# EAGLE design Teensy_Intan_Module_JE_20170512 (EAGLE 7.7.0)
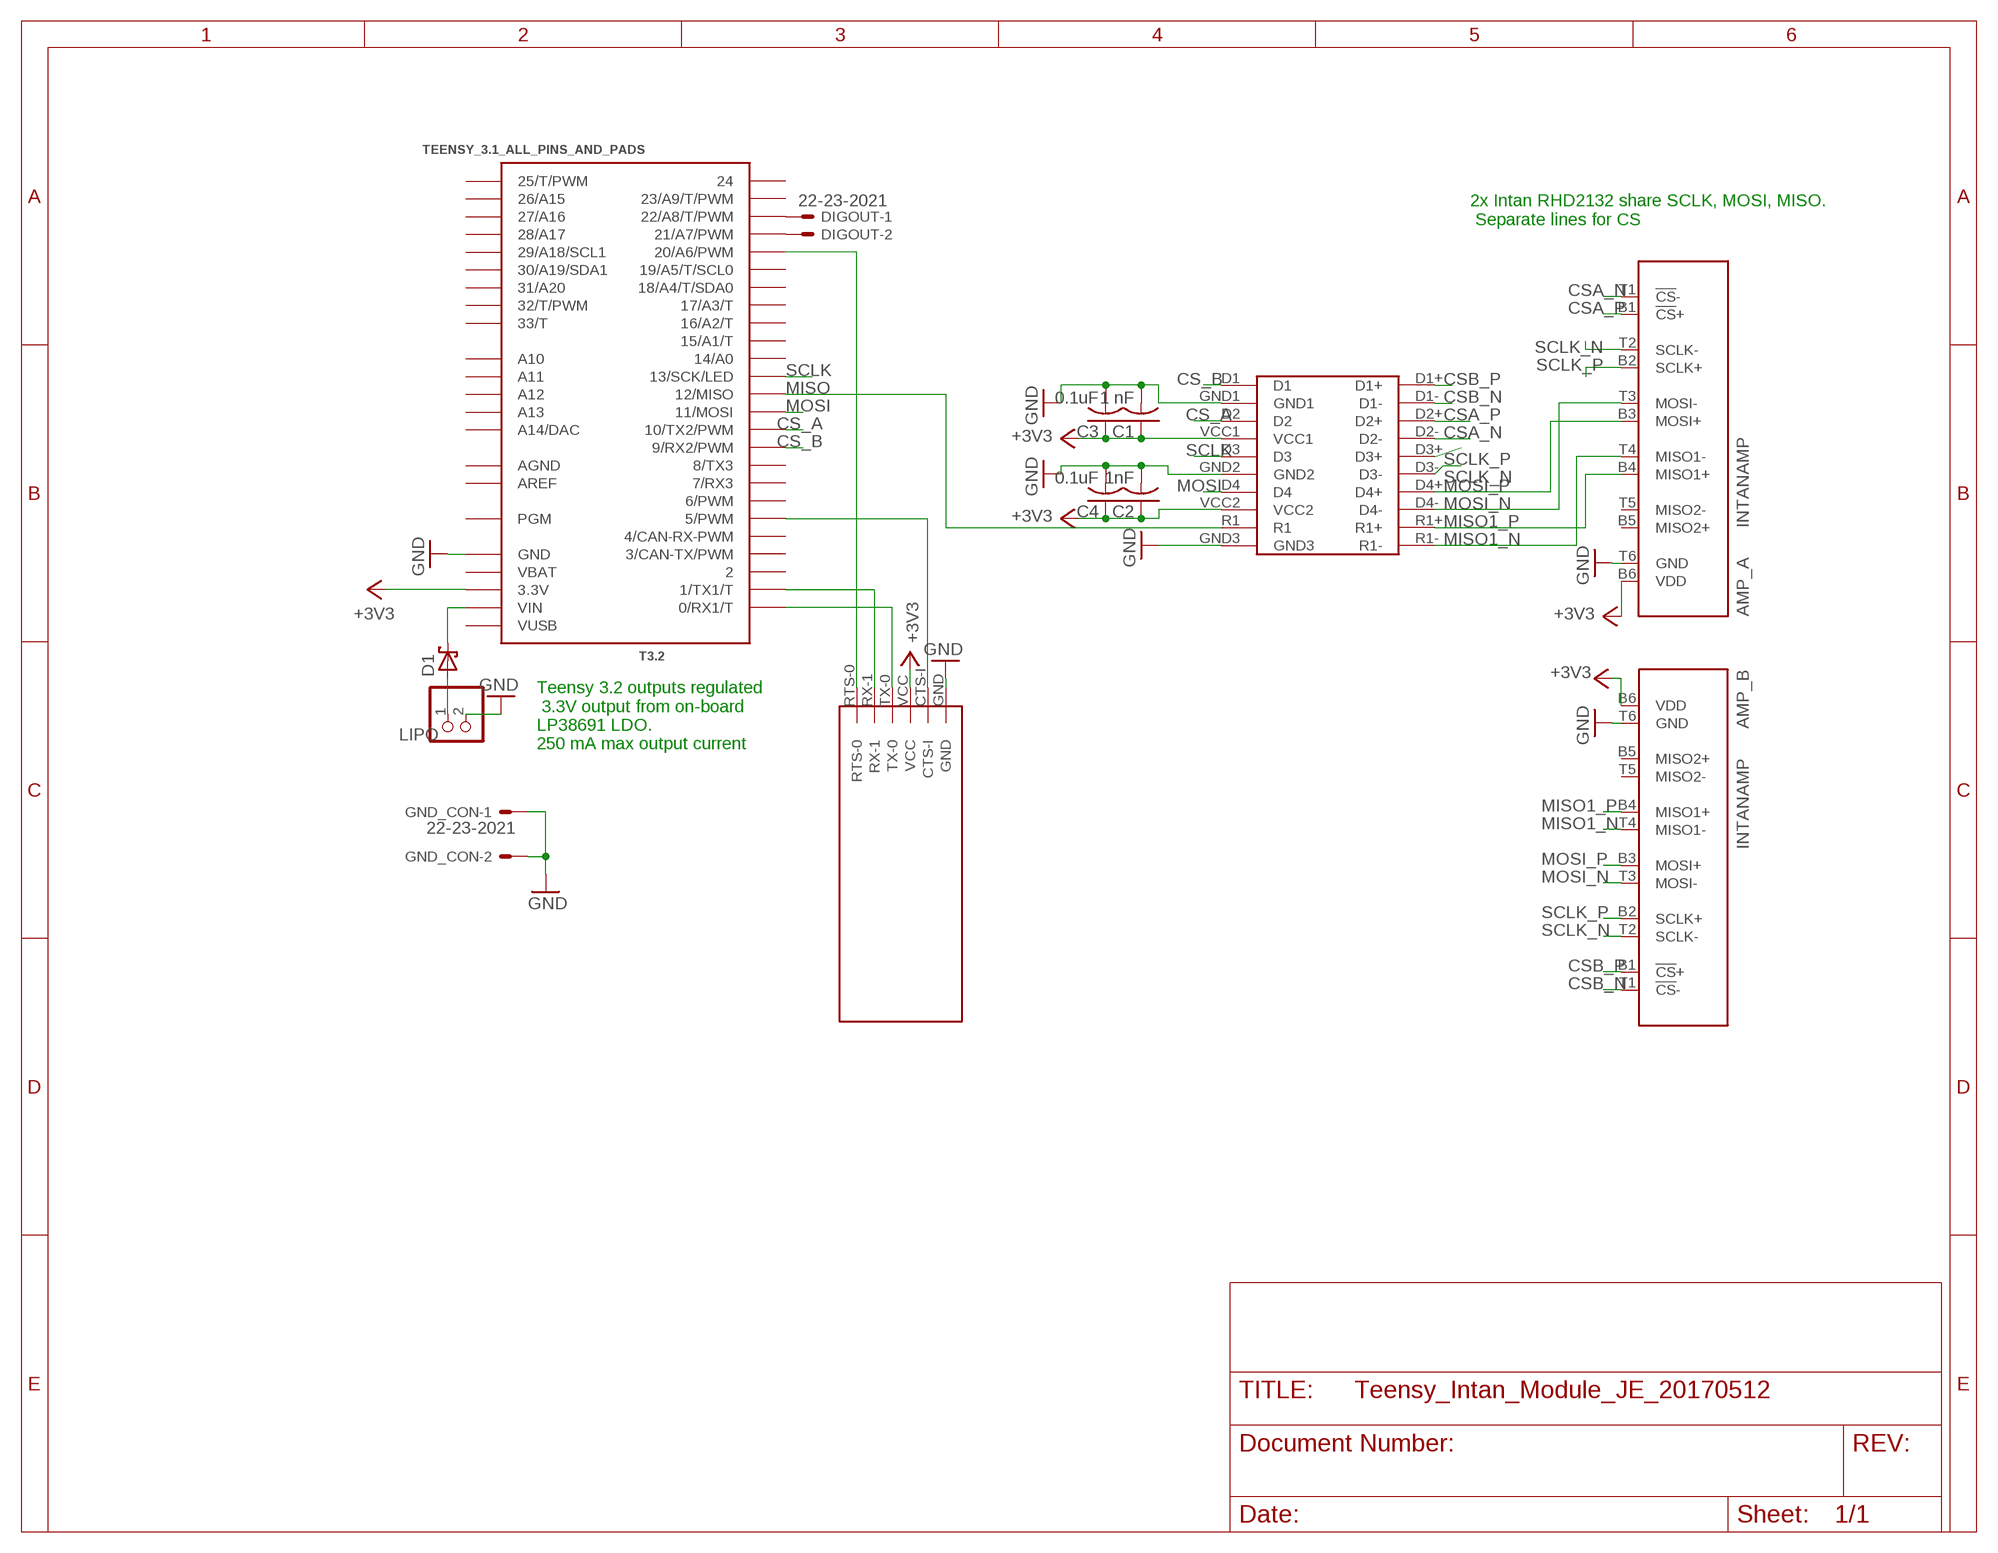
[diagram p0: schematic, sheet 1]

## Parts
AMP_A  INTANAMP  [AMPBOARD]
AMP_B  INTANAMP  [AMPBOARD]
C1  1 nF  C-US025-024X044  [C025-024X044]
C2  1nF  C-US025-024X044  [C025-024X044]
C3  0.1uF  C-US025-024X044  [C025-024X044]
C4  0.1uF  C-US025-024X044  [C025-024X044]
D1  SCHOTTKY-DIODEDO41-7  [DO41-7]
DIGOUT  22-23-2021  [22-23-2021]
GND_CON  22-23-2021  [22-23-2021]
LIPO  LIPO_BAT  JST_2PIN-THM  [JST-PH-2-THM]
RN42  RN42  [RN42]
T3.2  TEENSY_3.1_ALL_PINS_AND_PADS  [TEENSY_3.1_ALLPINS]
U$1  SCHMARTBOARD20PIN  [SCHMARTBOARD20PIN]

## Nets
+3V3: AMP_A.B6(VDD) AMP_B.B6(VDD) C1.1 C2.1 C3.1 C4.1 RN42.VCC T3.2.3.3V T3.2.3.3V1(3.3V) T3.2.3.3V2(3.3V) U$1.VCC1 U$1.VCC2
CS_A: T3.2.10(10/TX2/PWM) U$1.D2
CS_B: T3.2.9(9/RX2/PWM) U$1.D1
CSA_N: AMP_A.T1(!CS!-) U$1.D2-
CSA_P: AMP_A.B1(!CS!+) U$1.D2+
CSB_N: AMP_B.T1(!CS!-) U$1.D1-
CSB_P: AMP_B.B1(!CS!+) U$1.D1+
GND: AMP_A.T6(GND) AMP_B.T6(GND) C1.2 C2.2 C3.2 C4.2 GND_CON.1 GND_CON.2 LIPO.2 RN42.GND T3.2.GND T3.2.GND1(GND) T3.2.GND2(GND) U$1.GND1 U$1.GND2 U$1.GND3
MISO: T3.2.12(12/MISO) U$1.R1
MISO1_N: AMP_A.T4(MISO1-) AMP_B.T4(MISO1-) U$1.R1-
MISO1_P: AMP_A.B4(MISO1+) AMP_B.B4(MISO1+) U$1.R1+
MOSI: T3.2.11(11/MOSI) U$1.D4
MOSI_N: AMP_A.T3(MOSI-) AMP_B.T3(MOSI-) U$1.D4-
MOSI_P: AMP_A.B3(MOSI+) AMP_B.B3(MOSI+) U$1.D4+
N$1: D1.A LIPO.1
N$3: DIGOUT.1 T3.2.22/A8(22/A8/T/PWM)
N$4: DIGOUT.2 T3.2.21/A7(21/A7/PWM)
N$5: RN42.CTS-I T3.2.5(5/PWM)
N$6: RN42.RTS-0 T3.2.20/A6(20/A6/PWM)
RX-TN42: RN42.TX-0 T3.2.0(0/RX1/T)
SCLK: T3.2.13(13/SCK/LED) U$1.D3
SCLK_N: AMP_A.T2(SCLK-) AMP_B.T2(SCLK-) U$1.D3-
SCLK_P: AMP_A.B2(SCLK+) AMP_B.B2(SCLK+) U$1.D3+
TX-RN42: RN42.RX-1 T3.2.1(1/TX1/T)
VIN_LIPO: D1.C T3.2.VIN
Unconnected: AMP_A.B5(MISO2+) AMP_A.T5(MISO2-) AMP_B.B5(MISO2+) AMP_B.T5(MISO2-) T3.2.2 T3.2.3(3/CAN-TX/PWM) T3.2.4(4/CAN-RX-PWM) T3.2.6(6/PWM) T3.2.7(7/RX3) T3.2.8(8/TX3) T3.2.14/A0 T3.2.15/A1(15/A1/T) T3.2.16/A2(16/A2/T) T3.2.17/A3(17/A3/T) T3.2.18/A4(18/A4/T/SDA0) T3.2.19/A5(19/A5/T/SCL0) T3.2.23/A9(23/A9/T/PWM) T3.2.24 T3.2.25(25/T/PWM) T3.2.26(26/A15) T3.2.27(27/A16) T3.2.28(28/A17) T3.2.29(29/A18/SCL1) T3.2.30(30/A19/SDA1) T3.2.31(31/A20) T3.2.32(32/T/PWM) T3.2.33(33/T) T3.2.A10 T3.2.A11 T3.2.A12 T3.2.A13 T3.2.A14(A14/DAC) T3.2.PGM

## Notes on the sheet
- 2x Intan RHD2132 share SCLK, MOSI, MISO.
   Separate lines for CS
- Teensy 3.2 outputs regulated
   3.3V output from on-board 
  LP38691 LDO.
  250 mA max output current

## Power pins joined to a net without a drawn wire
AGND: T3.2.AGND
AREF: T3.2.AREF
VBAT: T3.2.VBAT
VUSB: T3.2.VUSB

## Library data of the parts
AMP_A AMP_B = INTANAMP:INTANAMP
C1-C4 = adafruit:C-US: CAPACITOR, American symbol
D1 = adafruit:SCHOTTKY-DIODE: Schottky Diode
DIGOUT GND_CON = con-molex:22-23-2021: .100" (2.54mm) Center Header - 2 Pin; MF: MOLEX; MPN: 22-23-2021; OC_FARNELL: 1462926; OC_NEWARK: 25C3832
LIPO = adafruit:JST_2PIN: JST 2-Pin Connectors of various flavors SMT-RA (S2B-PH-SM4) 4UConnector #17311 SMT (B2B-PH-SM4) THM-RA (S2B-PH) THM (B2B-PH)
RN42 = BLUETOOTH_MODULES:RN42
T3.2 = Teensy_3_Series_Board_v1.0:TEENSY_3.1_ALL_PINS_AND_PADS: Footprint for Teensy 3.1 board using all pads and all through-holes. Pads need a 2x7 0.1" SMD header.
U$1 = schmart:SCHMARTBOARD20PIN

## Board
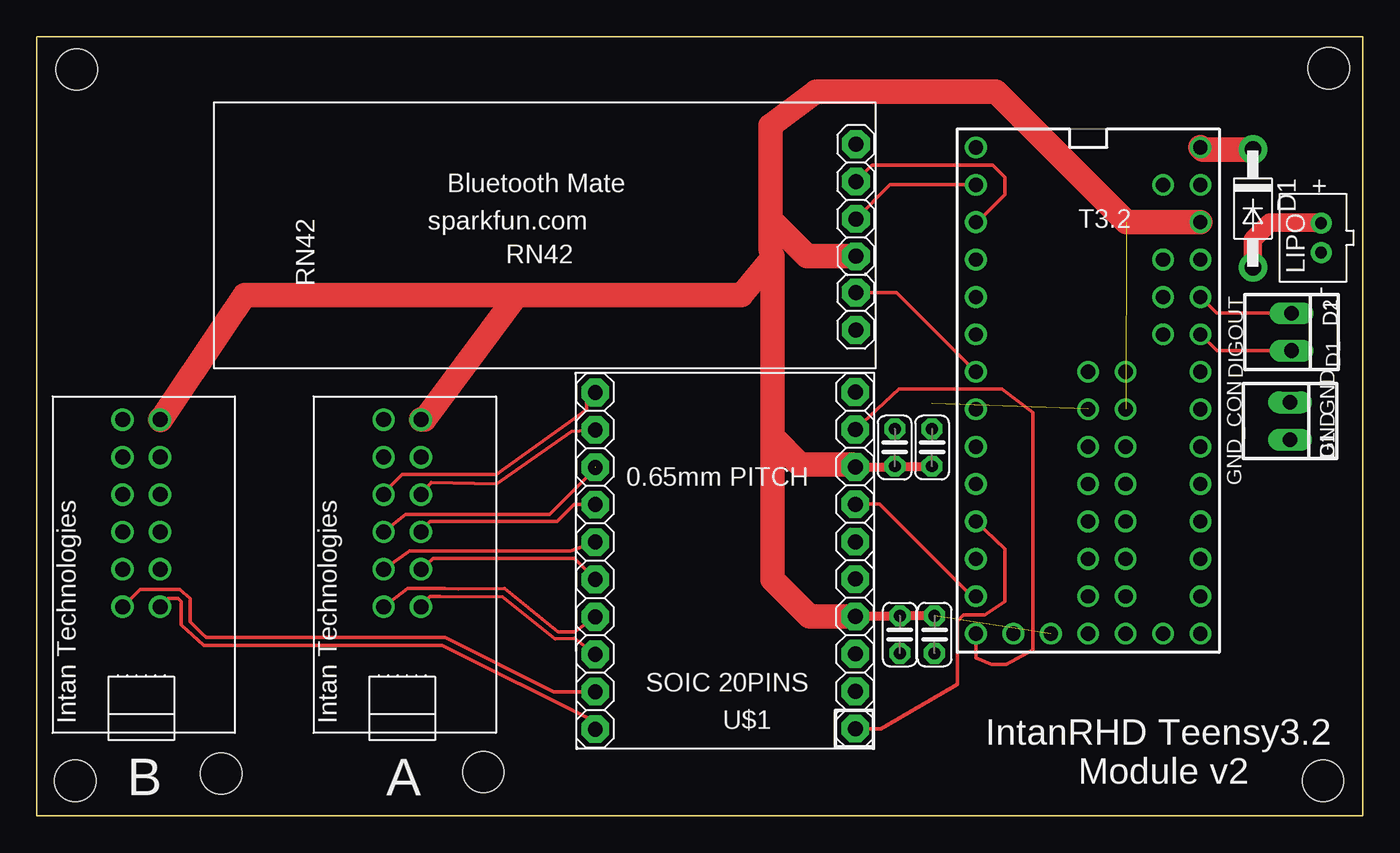
[diagram p1: board, top side]
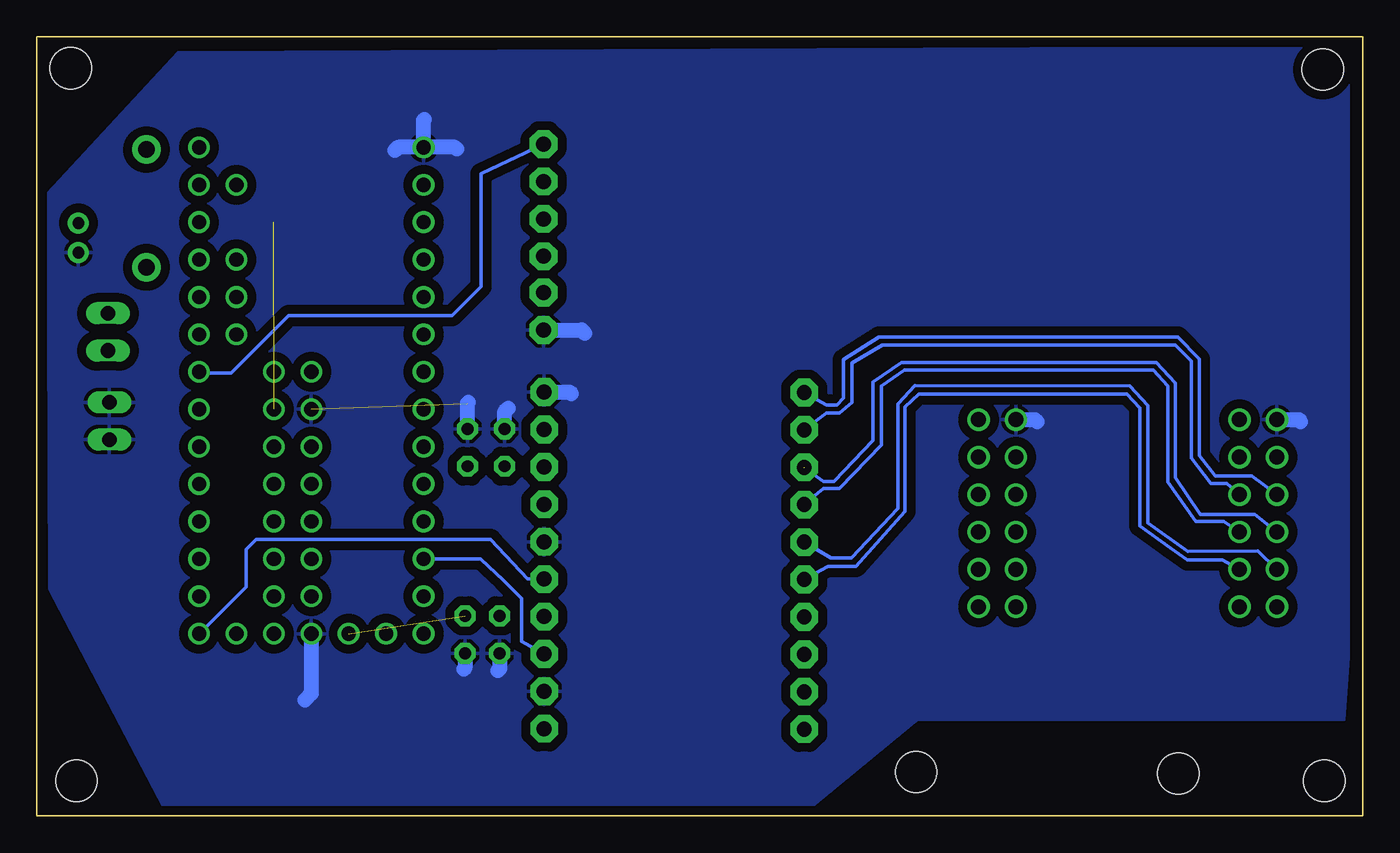
[diagram p2: board, bottom side, seen from below]

Size 90.01 x 52.91 mm. Coordinates in mm from the lower left corner, seen from the top.
Outline: 0,0 0,52.91 90.01,52.91 90.01,0 0,0
Copper layers (1*16): Top 0.035mm / dielectric 1.5mm / Bottom 0.035mm
Design rules "SeeedStudio_2layer_DRU_no_angle_20140221": minimum track width 6mil, minimum drill 12mil, track to track 6mil, track to pad 6mil, pad to pad 6mil, via to via 6mil, smd to smd 0mil, copper to edge 10mil, drill to drill 10mil, minimum pad ring 10mil, minimum via ring 6mil, stop-mask expansion 2mil, vias tented up to drill 100mil, thermal gap 10mil
Holes 2.8 mm at 30.31,2.99 12.51,2.89 2.71,50.69 2.61,2.39 87.31,2.39 87.71,50.79

### Footprints (pad centres in the part's own frame; a part is rotated, then mirrored left to right if it is on the bottom)
AMPBOARD = drill 1.016: B1 -2.857,-2.857; B2 -2.857,-0.318; B3 -2.857,2.223; B4 -2.857,4.763; B5 -2.857,7.303; B6 -2.857,9.842; T1 -5.397,-2.857; T2 -5.397,-0.318; T3 -5.397,2.223; T4 -5.397,4.763; T5 -5.397,7.303; T6 -5.397,9.842
C025-024X044 = drill 0.813 pad 1.422 octagon: 1 -1.27,0; 2 1.27,0
DO41-7 = drill 1.118 pad 1.93: A 4,0; C -4,0
22-23-2021 = drill 1 long: 1 -1.27,0; 2 1.27,0
JST-PH-2-THM = drill 0.8 pad 1.422: 1 1,0; 2 -1,0
RN42 = drill 1.016 pad 1.88 octagon: CTS-I -7.822,-23.538; GND -10.362,-23.538; RTS-0 2.258,-23.538; RX-1 -0.282,-23.538; TX-0 -2.822,-23.538; VCC -5.362,-23.538
TEENSY_3.1_ALLPINS = drill 0.965: 0 -7.62,15.24; 1 -7.62,12.7; 2 -7.62,10.16; 3 -7.62,7.62; 3.3V 7.62,12.7; 3.3V1 -2.54,-15.24; 3.3V2 2.54,0; 4 -7.62,5.08; 5 -7.62,2.54; 6 -7.62,0; 7 -7.62,-2.54; 8 -7.62,-5.08; 9 -7.62,-7.62; 10 -7.62,-10.16; 11 -7.62,-12.7; 12 -7.62,-15.24; 13 7.62,-15.24; 14/A0 7.62,-12.7; 15/A1 7.62,-10.16; 16/A2 7.62,-7.62; 17/A3 7.62,-5.08; 18/A4 7.62,-2.54; 19/A5 7.62,0; 20/A6 7.62,2.54; 21/A7 7.62,5.08; 22/A8 7.62,7.62; 23/A9 7.62,10.16; 24 0,-2.54; 25 0,-5.08; 26 0,-7.62; 27 0,-10.16; 28 0,-12.7; 29 2.54,-12.7; 30 2.54,-10.16; 31 2.54,-7.62; 32 2.54,-5.08; 33 2.54,-2.54; A10 5.08,7.62; A11 5.08,5.08; A12 0,2.54; A13 2.54,2.54; A14 5.08,-15.24; AGND 7.62,15.24; AREF 5.08,10.16; GND -7.62,17.78; GND1 0,-15.24; GND2 0,0; PGM 2.54,-15.24; VBAT -5.08,-15.24; VIN 7.62,17.78; VUSB 5.08,15.24
SCHMARTBOARD20PIN = drill 1.016 pad 1.88 octagon: D1 -5.715,12.675; D1+ 11.938,12.7; D1- 11.938,10.16; D2 -5.715,7.595; D2+ 11.938,7.62; D2- 11.938,5.08; D3 -5.715,2.515; D3+ 11.938,2.54; D3- 11.938,0; D4 -5.715,-2.565; D4+ 11.938,-2.54; D4- 11.938,-5.08; GND1 -5.715,10.135; GND2 -5.715,-0.025; GND3 -5.715,-10.185; R1 -5.715,-7.645; R1+ 11.938,-7.62; R1- 11.938,-10.16; VCC1 -5.715,5.055; VCC2 -5.715,-5.105

### Placement (x,y rotation side)
AMP_A  28.94,17.07 0 top
AMP_B  11.22,17.07 0 top
C1  58.58,12.32 270 top
C2  58.24,25.02 90 top
C3  60.94,12.32 270 top
C4  60.78,25.02 90 top
D1  82.56,41.25 270 top
DIGOUT  85.18,32.87 270 top
GND_CON  85.08,26.82 270 top
LIPO  87.19,39.26 90 top
RN42  32.07,43.37 90 top
T3.2  71.38,27.62 0 top
U$1  49.85,18.6 180 top

### Tracks (layer width: path | path; a pad name or v marks a point on that pad's centre or on a via)
+3V3  (2 unrouted)
  Top 0.61: U$1.VCC1 58.54,13.55 C1.1 C3.1 | U$1.VCC2 58.2,23.71 C2.1 C4.1
  Top 1.676: T3.2.3.3V 73.98,40.32 65.11,49.19 52.91,49.19 49.81,46.89 49.81,40.49 | 49.81,40.49 49.81,38.49 49.93,37.91 | RN42.VCC 52.29,38.01 49.81,40.49 | AMP_B.B6 8.39,26.91 8.41,26.89 14.11,35.39 32.61,35.39 | AMP_A.B6 26.34,26.91 32.61,35.39 | U$1.VCC1 52.45,13.55 49.93,16.07 49.93,25.77 | 49.93,38.01 49.93,37.91 | 49.93,37.91 49.93,25.77 | 49.93,25.77 51.81,23.89 55.39,23.89 U$1.VCC2 | 32.61,35.39 47.83,35.39 49.93,37.91
CS_A
  Bottom 0.254: T3.2.10 59.89,17.46 58.31,15.99 57.11,14.79 57.11,11.86 U$1.D2
CS_B
  Top 0.254: 55.61,5.89 U$1.D1 57.29,5.93 62.49,8.93 62.49,13.22 62.92,13.65 64.37,13.65 65.71,14.59 65.71,18.15 T3.2.9
CSA_N
  Top 0.254: U$1.D2- 36.51,12.52 35.4,12.52 31.77,15.46 28.6,15.42 27.67,15.45 25.18,15.45 AMP_A.T1
CSA_P
  Top 0.254: AMP_A.B1 26.7,14.93 27.37,14.93 31.61,14.89 35.18,12.03 36.51,12.06 U$1.D2+
CSB_N
  Top 0.254: U$1.D1- 35.08,8.44 27.71,12.12 11.51,12.12 11.21,12.39 10.41,13.19 10.41,14.79 9.71,15.39 7.01,15.39 AMP_B.T1
CSB_P
  Top 0.254: U$1.D1+ 37.91,6.39 27.51,11.59 11.31,11.59 9.81,12.99 9.81,14.59 9.61,14.79 8.91,14.79 8.91,14.76 AMP_B.B1
GND  (1 unrouted)
  Bottom 1.016: AMP_A.T6 22.23,26.91 22.11,26.79 | AMP_B.T6 4.33,26.91 4.21,26.79 | C1.2 58.58,10.02 58.71,9.89 | C3.2 60.94,10.06 61.01,9.99 | C2.2 58.24,27.46 58.01,27.69 | C4.2 60.78,28.02 60.71,28.09 | U$1.GND3 53.81,28.79 53.71,28.69 | RN42.GND 53.03,33.01 52.81,32.79 | T3.2.GND 61.63,45.4 61.51,45.29 | T3.2.GND 63.76,47.24 63.71,47.29 | T3.2.GND 65.5,45.4 65.71,45.19 | T3.2.GND1 71.38,8.32 71.81,7.89
  pour Bottom (isolate 0.61): 80.41,51.89 89.31,42.29 89.21,15.39 81.41,0.49 37.51,0.49 30.21,6.49 1.21,6.49 0.91,10.79 0.91,52.29
MISO
  Top 0.254: U$1.R1 58.53,28.99 65.51,28.99 67.61,27.39 67.61,11.29 65.81,10.29 64.81,10.29 63.76,10.74 T3.2.12
MISO1_N
  Top 0.254: AMP_A.T4 23.45,21.83 24.81,23.19 31.21,23.19 31.61,23.49 37.26,27.53 37.31,27.59 37.31,28.16 U$1.R1-
  Bottom 0.254: AMP_B.T4 7.51,23.09 10.01,23.09 11.09,24.48 11.09,31.04 12.54,32.52 32.83,32.52 35.24,31.01 35.24,28.39 35.7,27.92 36.41,27.92 U$1.R1-
MISO1_P
  Top 0.254: AMP_A.B4 26.68,22.54 26.77,22.66 31.21,22.56 36.31,26.12 U$1.R1+
  Bottom 0.254: AMP_B.B4 9.21,22.59 10.31,22.59 11.64,24.3 11.64,30.89 12.71,31.99 32.61,31.99 34.68,30.77 34.68,28.08 35.53,27.36 36.41,27.36 U$1.R1+
MOSI
  Top 0.254: T3.2.11 63.48,14.92 57.21,21.19 55.59,21.19 U$1.D4
MOSI_N  (1 unrouted)
  Top 0.254: 37.88,23.68 37.88,23.56 34.81,20.49 25.04,20.49 AMP_A.T3
  Bottom 0.254: U$1.D4- 36.61,22.72 35.9,22.72 33.24,25.48 33.24,29.49 31.31,30.79 14.01,30.79 12.71,29.39 12.71,22.99 11.01,20.49 7.31,20.49 AMP_B.T3
MOSI_P
  Top 0.254: AMP_A.B3 26.02,19.29 26.71,19.99 35.31,19.99 36.47,21.14 U$1.D4+
  Bottom 0.254: U$1.D4+ 36.61,22.26 35.52,22.26 32.68,25.19 32.68,29.19 31.11,30.29 14.21,30.29 13.21,29.19 13.21,22.69 11.31,19.99 9.41,19.99 AMP_B.B3
N$1
  Top 1.27: D1.A 82.56,39.13 83.71,40.29 87.16,40.29 LIPO.1
N$3
  Top 0.254: DIGOUT.1 80.1,34.14 T3.2.22/A8
N$4
  Top 0.254: DIGOUT.2 80.1,31.6 T3.2.21/A7
N$5
  Top 0.254: RN42.CTS-I 58.37,35.55 T3.2.5
N$6
  Bottom 0.254: RN42.RTS-0 59.85,43.63 59.85,35.95 61.81,33.99 72.91,33.99 76.81,30.09 78.92,30.09 T3.2.20/A6
RX-TN42
  Top 0.254: T3.2.0 57.93,42.86 RN42.TX-0
SCLK
  Bottom 0.254: U$1.D3 56.71,16.09 59.21,18.79 75.11,18.79 75.81,18.09 75.81,15.57 T3.2.13
SCLK_N
  Top 0.254: AMP_A.T2 25.31,17.99 32.51,17.99 36.24,18.01 U$1.D3-
  Bottom 0.254: U$1.D3- 36.11,17.52 34.71,17.52 31.54,20.88 31.54,27.99 30.4,29.22 15.8,29.21 14.58,27.87 14.59,19.89 11.86,17.96 7.11,17.99 AMP_B.T2
SCLK_P
  Top 0.254: AMP_A.B2 26.91,17.49 36.51,17.49 U$1.D3+
  Bottom 0.254: U$1.D3+ 36.31,16.96 34.41,16.96 31.08,20.7 31.08,27.79 30.13,28.66 16.02,28.66 15.14,27.7 15.14,19.68 13.06,18.22 11.91,17.39 9.51,17.39 AMP_B.B2
TX-RN42
  Top 0.254: T3.2.1 63.85,40.32 65.71,42.19 65.71,43.39 64.91,44.19 56.71,44.19 RN42.RX-1
VIN_LIPO
  Top 1.676: D1.C 79.15,45.25 T3.2.VIN

### Text on the board
tPlace: D1 | D1 | D2 | D1 | GND | D1 | GND | IntanRHD Teensy3.2 / Module v2 | B | A